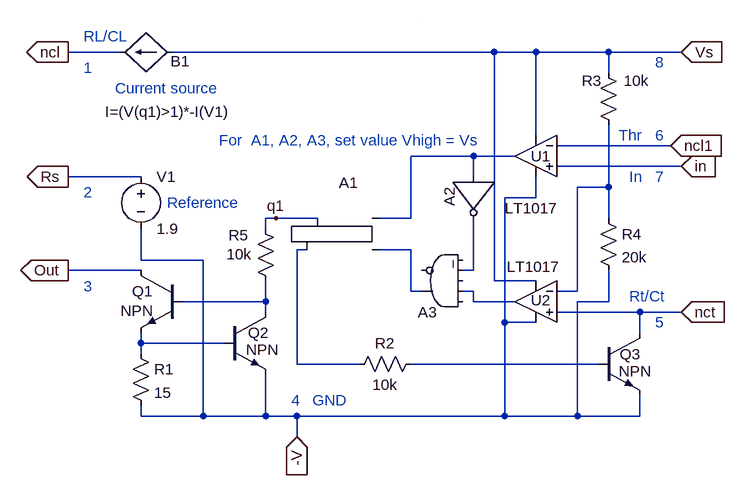
[diagram p0: schematic LM331m1.asc]
LM331m1.asc, the LTspice schematic file:
Version 4
SHEET 1 1364 772
WIRE 0 16 -80 16
WIRE 576 16 80 16
WIRE 640 16 576 16
WIRE 752 16 640 16
WIRE 864 16 752 16
WIRE 752 48 752 16
WIRE 640 144 640 16
WIRE 848 160 672 160
WIRE 544 176 448 176
WIRE 608 176 544 176
WIRE 864 192 672 192
WIRE 32 208 -80 208
WIRE 544 208 544 176
WIRE 752 224 752 128
WIRE 752 224 704 224
WIRE 640 240 640 208
WIRE 640 240 592 240
WIRE 240 272 224 272
WIRE 304 272 240 272
WIRE 448 272 448 176
WIRE 448 272 400 272
WIRE 752 272 752 224
WIRE 224 288 224 272
WIRE 288 320 272 320
WIRE 448 320 400 320
WIRE 32 336 32 288
WIRE 128 336 32 336
WIRE 32 352 -80 352
WIRE 544 352 544 272
WIRE 544 352 528 352
WIRE 576 368 576 16
WIRE 640 368 576 368
WIRE 448 384 448 320
WIRE 464 384 448 384
WIRE 544 384 528 384
WIRE 704 384 704 224
WIRE 704 384 672 384
WIRE 224 400 224 368
WIRE 224 400 96 400
WIRE 544 400 544 384
WIRE 608 400 544 400
WIRE 752 400 752 352
WIRE 752 400 704 400
WIRE 224 416 224 400
WIRE 800 416 672 416
WIRE 864 416 800 416
WIRE 592 432 592 240
WIRE 640 432 592 432
WIRE 800 448 800 416
WIRE 32 464 32 448
WIRE 160 464 32 464
WIRE 32 480 32 464
WIRE 272 496 272 320
WIRE 368 496 272 496
WIRE 736 496 448 496
WIRE 32 576 32 560
WIRE 128 576 128 336
WIRE 128 576 32 576
WIRE 224 576 224 512
WIRE 224 576 128 576
WIRE 272 576 224 576
WIRE 592 576 592 432
WIRE 592 576 272 576
WIRE 704 576 704 400
WIRE 704 576 592 576
WIRE 800 576 800 544
WIRE 800 576 704 576
WIRE 272 608 272 576
FLAG 240 272 q1
FLAG 864 192 in
IOPIN 864 192 In
FLAG -80 16 ncl
IOPIN -80 16 Out
FLAG 864 416 nct
IOPIN 864 416 In
FLAG 864 16 Vs
IOPIN 864 16 In
FLAG -80 208 Rs
IOPIN -80 208 Out
FLAG -80 352 Out
IOPIN -80 352 Out
FLAG 272 608 -V
IOPIN 272 608 In
FLAG 848 160 ncl1
IOPIN 848 160 In
SYMBOL bi 80 16 R90
WINDOW 0 30 -12 VBottom 2
WINDOW 3 76 6 VTop 2
SYMATTR InstName B1
SYMATTR Value I=(V(q1)>1)*-I(V1)
SYMBOL voltage 32 192 R0
WINDOW 123 0 0 Left 2
WINDOW 39 0 0 Left 2
SYMATTR InstName V1
SYMATTR Value 1.9
SYMBOL npn 96 352 M0
WINDOW 0 45 32 Left 2
WINDOW 3 45 62 Left 2
SYMATTR InstName Q1
SYMBOL npn 160 416 R0
WINDOW 0 37 32 Left 2
WINDOW 3 34 58 Left 2
SYMATTR InstName Q2
SYMBOL npn 736 448 R0
WINDOW 0 33 33 Left 2
WINDOW 3 32 59 Left 2
SYMATTR InstName Q3
SYMBOL res 16 464 R0
SYMATTR InstName R1
SYMATTR Value 15
SYMBOL res 464 480 R90
WINDOW 0 0 56 VBottom 2
WINDOW 3 32 56 VTop 2
SYMATTR InstName R2
SYMATTR Value 10k
SYMBOL Comparators\\LT1017 640 176 M0
WINDOW 0 -23 0 Left 2
WINDOW 3 -35 80 Left 2
SYMATTR InstName U1
SYMBOL Comparators\\LT1017 640 400 M0
WINDOW 0 -23 -2 Left 2
WINDOW 3 -38 -54 Left 2
SYMATTR InstName U2
SYMBOL Digital\\srflop 352 224 M0
WINDOW 0 -14 -7 Left 2
WINDOW 3 -14 100 Invisible 2
SYMATTR InstName A1
SYMATTR Value Vhigh=10
SYMBOL res 736 32 R0
WINDOW 0 -25 28 Left 2
WINDOW 3 39 28 Left 2
SYMATTR InstName R3
SYMATTR Value 10k
SYMBOL res 736 256 R0
SYMATTR InstName R4
SYMATTR Value 20k
SYMBOL Digital\\inv 480 208 M90
WINDOW 0 16 27 Left 2
WINDOW 3 8 58 Invisible 2
SYMATTR InstName A2
SYMATTR Value Vhigh=10
SYMBOL Digital\\and 496 432 R180
WINDOW 3 16 -2 Invisible 2
SYMATTR Value Vhigh=10
SYMATTR InstName A3
SYMBOL res 208 272 R0
WINDOW 0 -41 26 Left 2
WINDOW 3 -44 55 Left 2
SYMATTR InstName R5
SYMATTR Value 10k
TEXT 264 552 Left 2 ;4
TEXT -56 40 Left 2 ;1
TEXT -56 232 Left 2 ;2
TEXT -56 376 Left 2 ;3
TEXT 824 432 Left 2 ;5
TEXT 824 144 Left 2 ;6
TEXT 824 208 Left 2 ;7
TEXT 784 392 Left 2 ;Rt/Ct
TEXT 768 144 Left 2 ;Thr
TEXT 784 208 Left 2 ;In
TEXT -56 -8 Left 2 ;RL/CL
TEXT 296 552 Left 2 ;GND
TEXT -8 72 Left 2 ;Current source
TEXT 72 248 Left 2 ;Reference
TEXT 152 152 Left 2 ;For  A1, A2, A3, set value Vhigh = Vs
TEXT 824 32 Left 2 ;8
LINE Normal 464 -32 464 -32 2

The netlist it stands for:
* LM331m1.asc
B1 Vs ncl I=(V(q1)>1)*-I(V1)
V1 Rs -V 1.9
Q1 Out N007 N008 0 NPN
Q2 N007 N008 -V 0 NPN
Q3 nct N009 -V 0 NPN
R1 N008 -V 15
R2 N009 N003 10k
XU1 in ncl1 Vs -V N001 LT1017  ; pins In+ In- V+ V- OUT
XU2 nct N002 Vs -V N006 LT1017  ; pins In+ In- V+ V- OUT
A1 N001 N004 0 0 0 N003 q1 0 SRFLOP Vhigh=10
R3 Vs N002 10k
R4 N002 -V 20k
A2 N001 0 0 0 0 N005 0 0 BUF Vhigh=10
A3 0 N006 0 N005 0 0 N004 0 AND Vhigh=10
R5 q1 N007 10k
.model NPN NPN
.model PNP PNP
.lib standard.bjt
* 4
* 1
* 2
* 3
* 5
* 6
* 7
* Rt/Ct
* Thr
* In
* RL/CL
* GND
* Current source
* Reference
* For  A1, A2, A3, set value Vhigh = Vs
* 8
.backanno
.end